# Altium schematic sheet 04_gap_interface.SchDoc: BioGAP ExG shield
size A2; Author: Sebastian Frey; DrawnBy: Sebastian Frey; Engineer: Sebastian Frey; Organization: Integrated System Laboratory; DocumentNumber: 4; Revision: v1.0; SheetNumber: 4; SheetTotal: 4
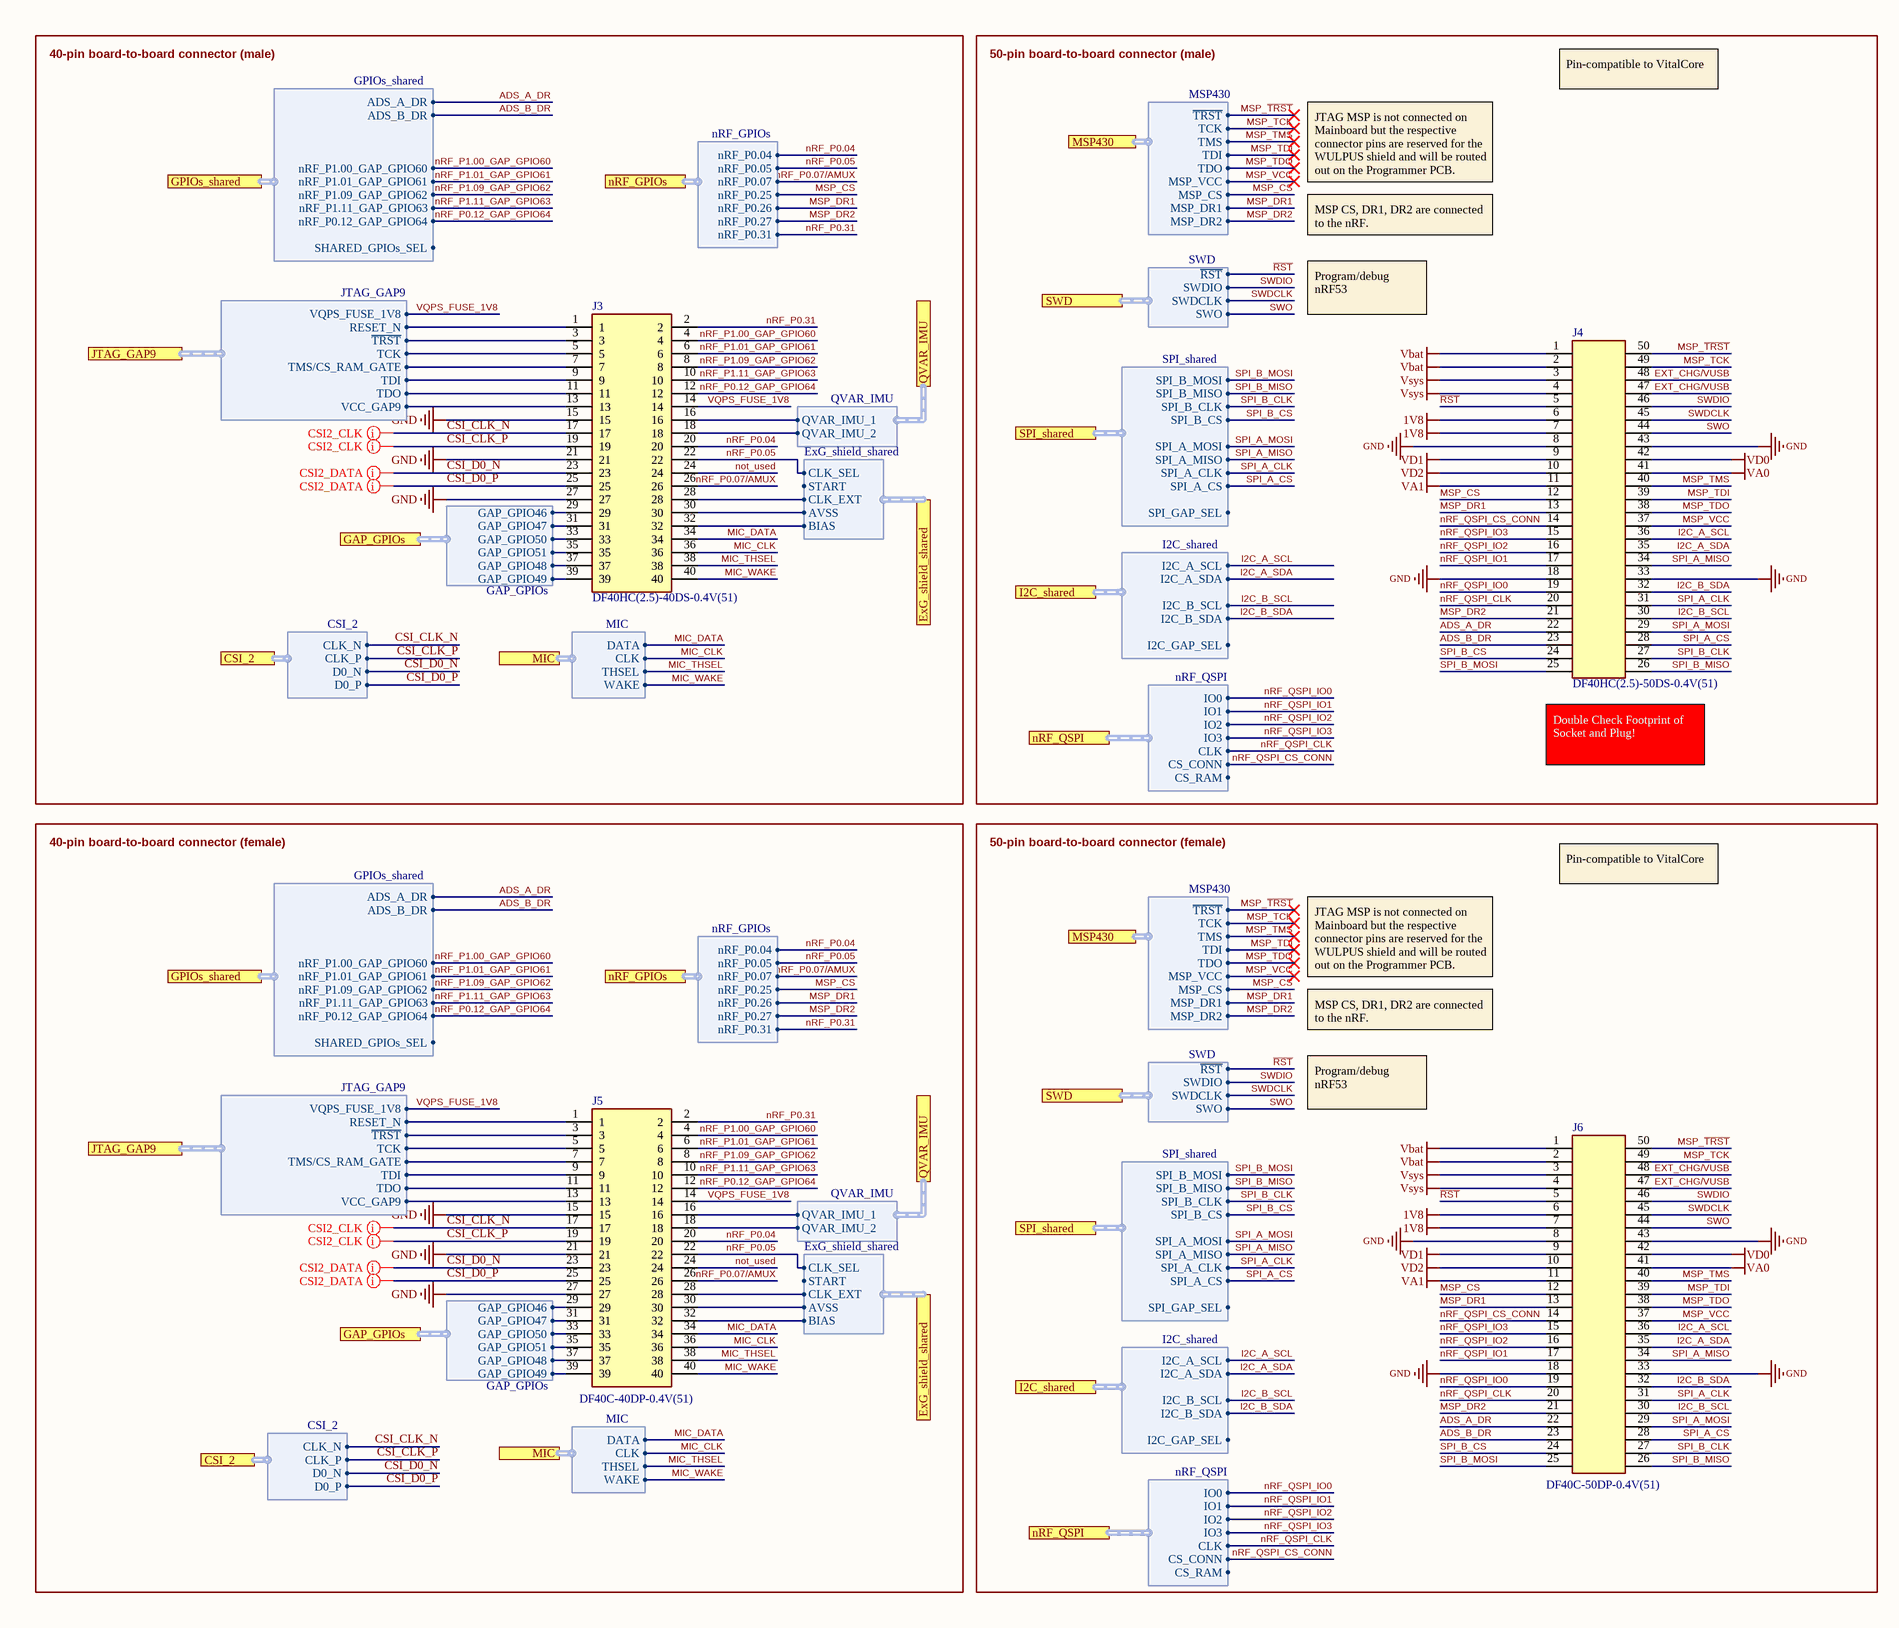
[diagram p0: 04_gap_interface.SchDoc, left]
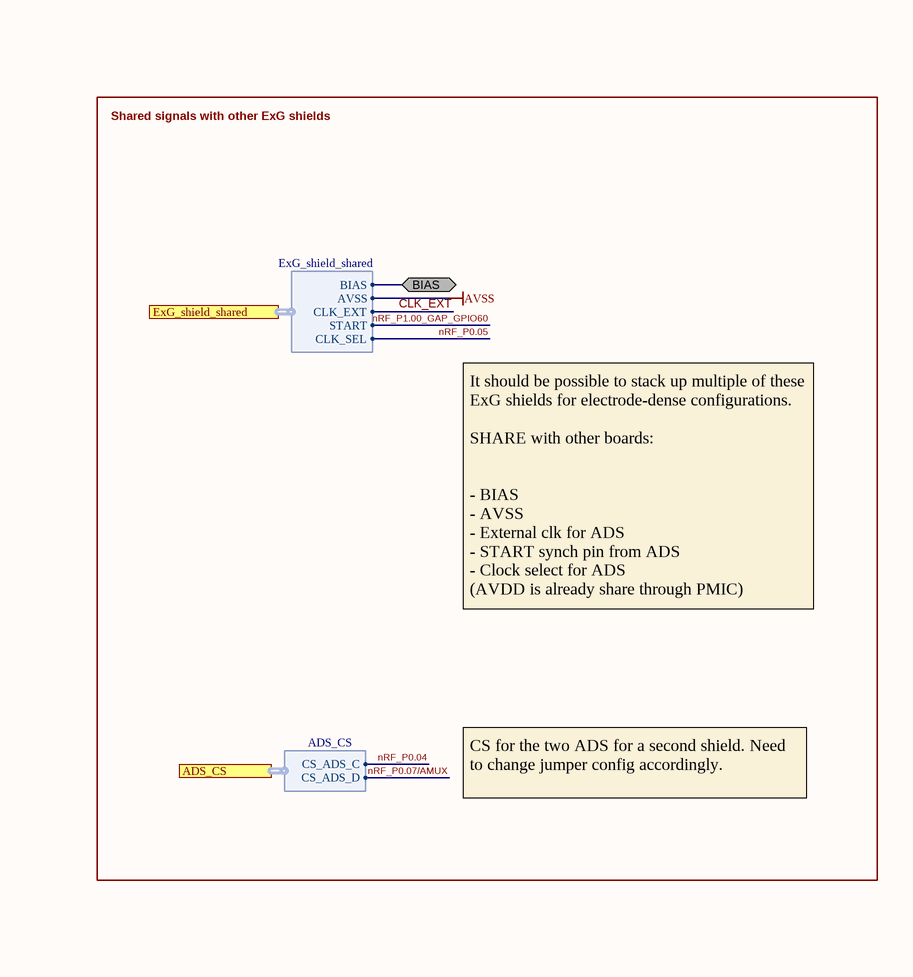
[diagram p1: 04_gap_interface.SchDoc, right]

## Parts
J3  DF40HC(2.5)-40DS-0.4V(51)  [DF40HC3040DS04V51]
J4  DF40HC(2.5)-50DS-0.4V(51)  [DF40HC3050DS04V51]
J5  DF40C-40DP-0.4V(51)  [FP-DF40C-40DP-0_4V_51-MFG]
J6  DF40C-50DP-0.4V(51)  [CONN_COMBI_50P]

## Blocks framed on the sheet
40-pin board-to-board connector (male): J3
50-pin board-to-board connector (male): J4
40-pin board-to-board connector (female): J5
50-pin board-to-board connector (female): J6

## Ports
ADS_CS (harness ADS_CS), BIAS (bidir), CSI_2 (harness CSI_2), ExG_shield_shared (harness ExG_shield_shared), GAP_GPIOs (harness GAP_GPIOs), GPIOs_shared (harness GPIOs_shared), I2C_shared (harness I2C_shared), JTAG_GAP9 (harness JTAG_GAP9), MIC (harness MIC), MSP430 (harness MSP430), nRF_GPIOs (harness nRF_GPIOs), nRF_QSPI (harness nRF_QSPI), QVAR_IMU (harness QVAR_IMU), SPI_shared (harness SPI_shared), SWD (harness SWD)

## Harnesses
QVAR_IMU: QVAR_IMU_2, QVAR_IMU_1
MIC: DATA, THSEL, WAKE, CLK
GAP_GPIOs: GAP_GPIO46, GAP_GPIO47, GAP_GPIO50, GAP_GPIO51, GAP_GPIO48, GAP_GPIO49
GPIOs_shared: ADS_A_DR, ADS_B_DR, nRF_P1.00_GAP_GPIO60, nRF_P1.09_GAP_GPIO62, nRF_P1.11_GAP_GPIO63, nRF_P0.12_GAP_GPIO64, SHARED_GPIOs_SEL, nRF_P1.01_GAP_GPIO61
nRF_GPIOs: nRF_P0.07, nRF_P0.25, nRF_P0.05, nRF_P0.04, nRF_P0.26, nRF_P0.27, nRF_P0.31
CSI_2: CLK_N, CLK_P, D0_P, D0_N
JTAG_GAP9: ~{TRST}, TCK, TMS/CS_RAM_GATE, TDI, TDO, VCC_GAP9, RESET_N, VQPS_FUSE_1V8
SWD: ~{RST}, SWDIO, SWDCLK, SWO
nRF_QSPI: IO0, IO1, IO2, IO3, CLK, CS_CONN, CS_RAM
SPI_shared: SPI_B_MOSI, SPI_B_MISO, SPI_B_CLK, SPI_B_CS, SPI_A_MOSI, SPI_A_MISO, SPI_A_CLK, SPI_A_CS, SPI_GAP_SEL
I2C_shared: I2C_A_SCL, I2C_A_SDA, I2C_B_SCL, I2C_B_SDA, I2C_GAP_SEL
MSP430: ~{TRST}, TCK, TMS, TDI, TDO, MSP_VCC, MSP_DR1, MSP_DR2, MSP_CS
ExG_shield_shared: BIAS, AVSS, CLK_EXT, START, CLK_SEL
ADS_CS: CS_ADS_C, CS_ADS_D

## Nets
1V8: J4.6 J4.7 J6.6 J6.7
AVSS: J3.30 J5.30 ; port ExG_shield_shared.AVSS
GND: J3.15 J3.21 J3.27 J4.8 J4.18 J4.33 J4.43 J5.15 J5.21 J5.27 J6.8 J6.18 J6.33 J6.43
VA0: J4.41 J6.41
VA1: J4.11 J6.11
Vbat: J4.1 J4.2 J6.1 J6.2
VD0: J4.42 J6.42
VD1: J4.9 J6.9
VD2: J4.10 J6.10
Vsys: J4.3 J4.4 J6.3 J6.4
ADS_A_DR: J4.22 J6.22 ; port GPIOs_shared.ADS_A_DR
ADS_B_DR: J4.23 J6.23 ; port GPIOs_shared.ADS_B_DR
BIAS: J3.32 J5.32 ; port BIAS, port ExG_shield_shared.BIAS
CLK_EXT: J3.28 J5.28 ; port ExG_shield_shared.CLK_EXT
CSI_CLK_N: J3.17 J5.17 ; port CSI_2.CLK_N
CSI_CLK_P: J3.19 J5.19 ; port CSI_2.CLK_P
CSI_D0_N: J3.23 J5.23 ; port CSI_2.D0_N
CSI_D0_P: J3.25 J5.25 ; port CSI_2.D0_P
EXT_CHG/VUSB: J4.47 J4.48 J6.47 J6.48
I2C_A_SCL: J4.36 J6.36 ; port I2C_shared.I2C_A_SCL
I2C_A_SDA: J4.35 J6.35 ; port I2C_shared.I2C_A_SDA
I2C_B_SCL: J4.30 J6.30 ; port I2C_shared.I2C_B_SCL
I2C_B_SDA: J4.32 J6.32 ; port I2C_shared.I2C_B_SDA
MIC_CLK: J3.36 J5.36 ; port MIC.CLK
MIC_DATA: J3.34 J5.34 ; port MIC.DATA
MIC_THSEL: J3.38 J5.38 ; port MIC.THSEL
MIC_WAKE: J3.40 J5.40 ; port MIC.WAKE
MSP_CS: J4.12 J6.12 ; port nRF_GPIOs.nRF_P0.25, port MSP430.MSP_CS
MSP_DR1: J4.13 J6.13 ; port nRF_GPIOs.nRF_P0.26, port MSP430.MSP_DR1
MSP_DR2: J4.21 J6.21 ; port nRF_GPIOs.nRF_P0.27, port MSP430.MSP_DR2
MSP_~{TRST}: J4.50 J6.50 ; port MSP430.~{TRST}
MSP_TCK: J4.49 J6.49 ; port MSP430.TCK
MSP_TDI: J4.39 J6.39 ; port MSP430.TDI
MSP_TDO: J4.38 J6.38 ; port MSP430.TDO
MSP_TMS: J4.40 J6.40 ; port MSP430.TMS
MSP_VCC: J4.37 J6.37 ; port MSP430.MSP_VCC
not_used: J3.24 J5.24
nRF_P0.04: J3.20 J5.20 ; port nRF_GPIOs.nRF_P0.04, port ADS_CS.CS_ADS_C
nRF_P0.05: J3.22 J5.22 ; port nRF_GPIOs.nRF_P0.05, port ExG_shield_shared.CLK_SEL
nRF_P0.07/AMUX: J3.26 J5.26 ; port nRF_GPIOs.nRF_P0.07, port ADS_CS.CS_ADS_D
nRF_P0.12_GAP_GPIO64: J3.12 J5.12 ; port GPIOs_shared.nRF_P0.12_GAP_GPIO64
nRF_P0.31: J3.2 J5.2 ; port nRF_GPIOs.nRF_P0.31
nRF_P1.00_GAP_GPIO60: J3.4 J5.4 ; port GPIOs_shared.nRF_P1.00_GAP_GPIO60, port ExG_shield_shared.START
nRF_P1.01_GAP_GPIO61: J3.6 J5.6 ; port GPIOs_shared.nRF_P1.01_GAP_GPIO61
nRF_P1.09_GAP_GPIO62: J3.8 J5.8 ; port GPIOs_shared.nRF_P1.09_GAP_GPIO62
nRF_P1.11_GAP_GPIO63: J3.10 J5.10 ; port GPIOs_shared.nRF_P1.11_GAP_GPIO63
nRF_QSPI_CLK: J4.20 J6.20 ; port nRF_QSPI.CLK
nRF_QSPI_CS_CONN: J4.14 J6.14 ; port nRF_QSPI.CS_CONN
nRF_QSPI_IO0: J4.19 J6.19 ; port nRF_QSPI.IO0
nRF_QSPI_IO1: J4.17 J6.17 ; port nRF_QSPI.IO1
nRF_QSPI_IO2: J4.16 J6.16 ; port nRF_QSPI.IO2
nRF_QSPI_IO3: J4.15 J6.15 ; port nRF_QSPI.IO3
~{RST}: J4.5 J6.5 ; port SWD.~{RST}
SPI_A_CLK: J4.31 J6.31 ; port SPI_shared.SPI_A_CLK
SPI_A_CS: J4.28 J6.28 ; port SPI_shared.SPI_A_CS
SPI_A_MISO: J4.34 J6.34 ; port SPI_shared.SPI_A_MISO
SPI_A_MOSI: J4.29 J6.29 ; port SPI_shared.SPI_A_MOSI
SPI_B_CLK: J4.27 J6.27 ; port SPI_shared.SPI_B_CLK
SPI_B_CS: J4.24 J6.24 ; port SPI_shared.SPI_B_CS
SPI_B_MISO: J4.26 J6.26 ; port SPI_shared.SPI_B_MISO
SPI_B_MOSI: J4.25 J6.25 ; port SPI_shared.SPI_B_MOSI
SWDCLK: J4.45 J6.45 ; port SWD.SWDCLK
SWDIO: J4.46 J6.46 ; port SWD.SWDIO
SWO: J4.44 J6.44 ; port SWD.SWO
VQPS_FUSE_1V8: J3.14 J5.14 ; port JTAG_GAP9.VQPS_FUSE_1V8
NetJ3_1: J3.1 J5.1 ; port JTAG_GAP9.RESET_N
NetJ3_3: J3.3 J5.3 ; port JTAG_GAP9.~{TRST}
NetJ3_5: J3.5 J5.5 ; port JTAG_GAP9.TCK
NetJ3_7: J3.7 J5.7 ; port JTAG_GAP9.TMS/CS_RAM_GATE
NetJ3_9: J3.9 J5.9 ; port JTAG_GAP9.TDI
NetJ3_11: J3.11 J5.11 ; port JTAG_GAP9.TDO
NetJ3_13: J3.13 J5.13 ; port JTAG_GAP9.VCC_GAP9
NetJ3_16: J3.16 J5.16 ; port QVAR_IMU.QVAR_IMU_1
NetJ3_18: J3.18 J5.18 ; port QVAR_IMU.QVAR_IMU_2
NetJ3_29: J3.29 J5.29 ; port GAP_GPIOs.GAP_GPIO46
NetJ3_31: J3.31 J5.31 ; port GAP_GPIOs.GAP_GPIO47
NetJ3_33: J3.33 J5.33 ; port GAP_GPIOs.GAP_GPIO50
NetJ3_35: J3.35 J5.35 ; port GAP_GPIOs.GAP_GPIO51
NetJ3_37: J3.37 J5.37 ; port GAP_GPIOs.GAP_GPIO48
NetJ3_39: J3.39 J5.39 ; port GAP_GPIOs.GAP_GPIO49

## Layout directives
net class CSI2_CLK: CSI_CLK_N, CSI_CLK_P
net class CSI2_DATA: CSI_D0_N, CSI_D0_P

## Notes on the sheet
- Pin-compatible to VitalCore
- JTAG MSP is not connected on Mainboard but the respective connector pins are reserved for the WULPUS shield and will be routed out on the Programmer PCB.
- MSP CS, DR1, DR2 are connected to the nRF.
- Program/debug nRF53
- Shared signals with other ExG shields
- (near J4) Double Check Footprint of Socket and Plug!
- It should be possible to stack up multiple of these ExG shields for electrode-dense configurations.
  SHARE with other boards:
  - BIAS
  - AVSS
  - External clk for ADS
  - START synch pin from ADS
  - Clock select for ADS
  (AVDD is already share through PMIC)
- CS for the two ADS for a second shield. Need to change jumper config accordingly.
- Drawing title:
- Drawing number:
- Rev:
- Format:
- Laboratory:
- Project:
- File:
- Date:
- A2
- Drawn by:
- Page
- of

## Library data of the parts
J3 = DF40HC(3.0)-40DS-0.4V(51): 40 Position 0.4mm Pitch Dual Row Vertical Surface Mount (SMT) Pin Socket, 2.5mm Stacking Height; System: Connector; Package: None; Availability: Unavailable; Value: *; MP: DF40HC(3.0)-40DS-0.4V(51); Price: None
J4 = DF40HC(3.0)-50DS-0.4V(51): 50 Position 0.4mm Pitch Dual Row Vertical Surface Mount (SMT) Pin Socket, 2.5mm Stacking Height; Mfr_Name: Hirose; Copyright: Copyright (C) 2023 Ultra Librarian. All rights reserved.; Manufacturer_Part_Number: DF40HC(3.0)-50DS-0.4V(51); RefDes: RefDes; Type: DEV
J5 = DF40C-40DP-0.4V(51): 50 Position 0.4mm Pitch Dual Row Vertical Surface Mount (SMT) Receptacle; Connector Type: Plug; Number of Contacts: 40; Gender: Male; Voltage Rating: 30V; Mated Stacking Heights: 4mm; Current Rating: 300mA; System: Connector; Lead Free: Lead Free; Number of Positions: 40; Packaging: Tape and Reel; Contact Plating: Gold; REACH SVHC: No SVHC; Mount: Surface Mount; Orientation: Straight; Housing Material: Polymer; Termination: SMD/SMT; Min Operating Temperature: -35°C; Number of Rows: 2; Max Operating Temperature: 85°C; Pitch: 0.4mm; Contact Material: Bronze; Package Quantity: 1
J6 = DF40C-50DP-0.4V(51): 50 Position 0.4mm Pitch Dual Row Vertical Surface Mount (SMT) Receptacle,; Mfr_Name: Hirose; System: Connector; Copyright: Copyright (C) 2023 Ultra Librarian. All rights reserved.; Manufacturer_Part_Number: DF40C-50DP-0.4V(51); RefDes: RefDes; Type: DEV